# EAGLE board 14140^6 (EAGLE 7.6.0)
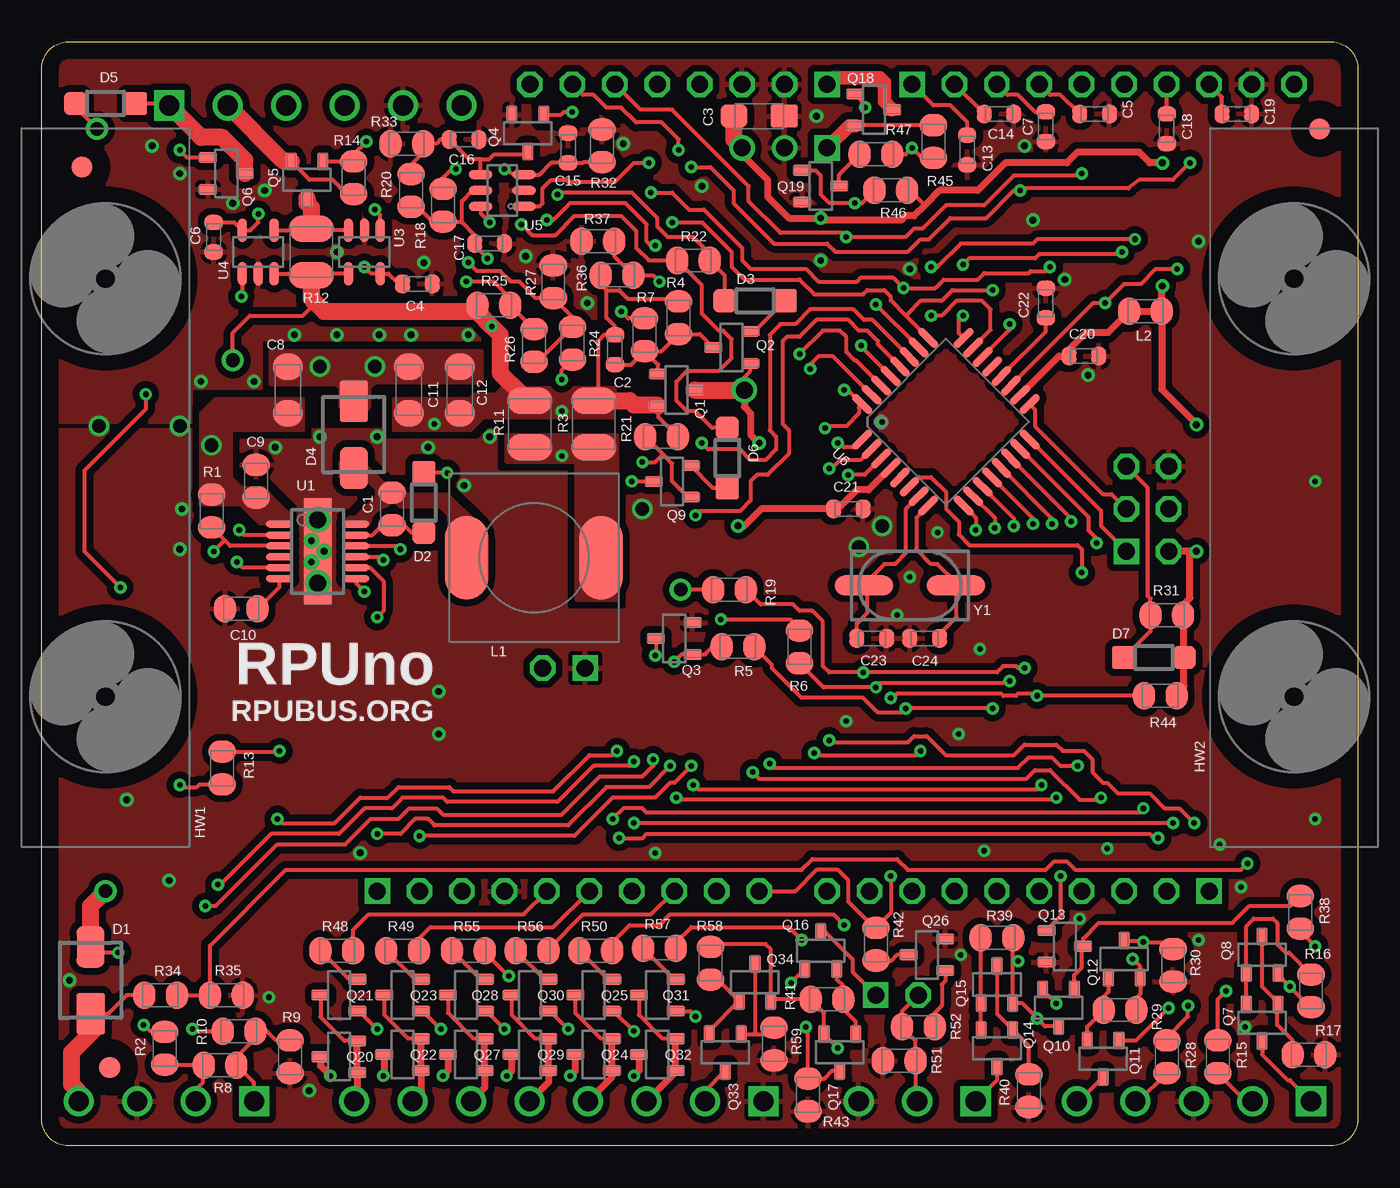
[diagram p1: board, top side]
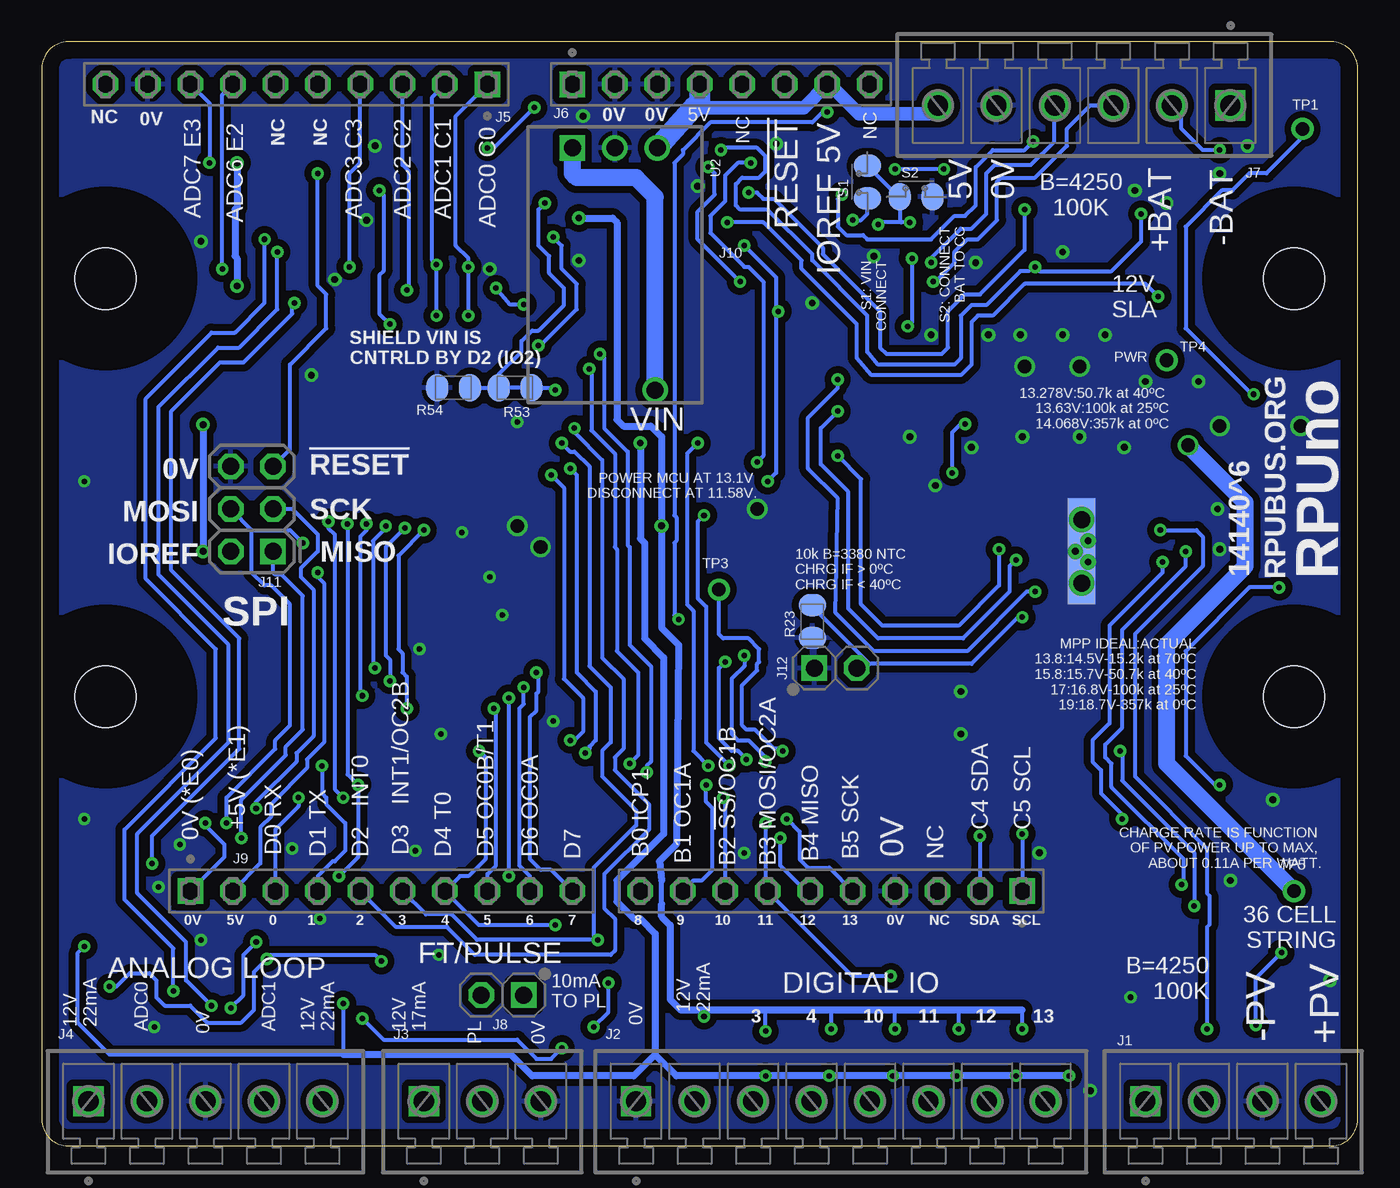
[diagram p2: board, bottom side, seen from below]

Size 78.74 x 66.04 mm. Coordinates in mm from the lower left corner, seen from the top.
Outline: 78.74,64.45 78.74,1.59 arc-90 77.15,0 1.59,0 arc-90 0,1.59 0,64.45 arc-90 1.59,66.04 77.15,66.04 arc-90 78.74,64.45
Copper layers (1*16): Top 0.034290625mm / dielectric 60mil / Bottom 0.034290625mm
Design rules "default *": minimum track width 10mil, minimum drill 13mil, track to track 12mil, track to pad 10mil, pad to pad 8mil, via to via 12mil, smd to smd 8mil, copper to edge 40mil, drill to drill 16mil, minimum pad ring 10mil, minimum via ring 8mil, stop-mask expansion 4mil, vias tented up to drill 17mil, thermal gap 10mil
Net classes: 0 default: width 0.254 mm, drill 0.33 mm

## Footprints (pad centres in the part's own frame; a part is rotated, then mirrored left to right if it is on the bottom)
C0805(2012) = smd 1.321 x 1.651: 1 -0.977,0; 2 0.977,0
C0603(1608) = smd 0.898 x 1.1: 1 -0.889,0; 2 0.889,0
3216 = smd 1.6 x 1.4: + -1.5,0; - 1.5,0
C1206(3216) = smd 1.6 x 1.8: 1 -1.4,0; 2 1.4,0
SMA = smd 2.5 x 1.7: A 2,0; K -2,0
SOD123 = smd 1.4 x 1.4: A 1.8,0; C -1.8,0
USA10 = hole 3.658: -12.5,0; 12.5,0
MCV4 = drill 1.2 square: 1 0,0 | drill 1.2: 2 3.5,0; 3 7,0; 4 10.5,0
MCV8 = drill 1.2 square: 1 0,0 | drill 1.2: 2 3.5,0; 3 7,0; 4 10.5,0; 5 14,0; 6 17.5,0; 7 21,0; 8 24.5,0
MCV3 = drill 1.2 square: 1 0,0 | drill 1.2: 2 3.5,0; 3 7,0
MCV5 = drill 1.2 square: 1 0,0 | drill 1.2: 2 3.5,0; 3 7,0; 4 10.5,0; 5 14,0
F1X10 = drill 1.016 square: 1 0,0 | drill 1.016 octagon: 2 2.54,0; 3 5.08,0; 4 7.62,0; 5 10.16,0; 6 12.7,0; 7 15.24,0; 8 17.78,0; 9 20.32,0; 10 22.86,0
F1X8 = drill 1.016 square: 1 0,0 | drill 1.016 octagon: 2 2.54,0; 3 5.08,0; 4 7.62,0; 5 10.16,0; 6 12.7,0; 7 15.24,0; 8 17.78,0
MCV6 = drill 1.2 square: 1 0,0 | drill 1.2: 2 3.5,0; 3 7,0; 4 10.5,0; 5 14,0; 6 17.5,0
1X2 = drill 1.016 square: 1 0,0 | drill 1.016 octagon: 2 2.54,0
ISP = drill 1.016 square: 1 0,0 | drill 1.016 octagon: 2 0,2.54; 3 2.54,0; 4 2.54,2.54; 5 5.08,0; 6 5.08,2.54
L3939 = smd 2.6 x 5: 1 4.05,0; 2 -4.01,0
SOT23 = smd 0.65 x 1.06: 1(G) -0.95,-1.1; 2(S) 0.95,-1.1; 3(D) 0,1.1
SOT23' = smd 0.65 x 1.06: B -0.95,-1.1; C 0,1.1; E 0.95,-1.1
C1210(3225) = smd 1.6 x 2.7: 1 -1.4,0; 2 1.4,0
P1-08 = drill 0.813: TP 0,0
12MSOP-EDP-HAND = smd 0.42 x 1.6: 1 -1.625,-2.3; 2 -0.975,-2.3; 3 -0.325,-2.3; 4 0.325,-2.3; 5 0.975,-2.3; 6 1.625,-2.3; 7 1.625,2.3; 8 0.975,2.3; 9 0.325,2.3; 10 -0.325,2.3; 11 -0.975,2.3; 12 -1.625,2.3 | smd 6.35 x 1.651: SNK0 0,0 | smd 6.35 x 1.651 bottom: SNK1 0,0 | drill 1.016: SNK3 -1.905,0; SNK5 1.905,0 | drill 0.406: SNK4 0,0.381; SNK6 -0.635,-0.381; SNK7 0.635,-0.381
OKI-78SR-H = drill 1.016 square: 1 0,0 | drill 1.016: 2 -2.54,0; 3 -5.08,0
SOT23-5 = smd 0.55 x 1.4: 1 -0.95,-1.3; 2 0,-1.3; 3 0.95,-1.3; 4 0.95,1.3; 5 -0.95,1.3
SOT23-6 = smd 0.55 x 1.4: 1 -0.95,-1.3; 2 0,-1.3; 3 0.95,-1.3; 4 0.95,1.3; 5 0,1.3; 6 -0.95,1.3
TQFP32-08 = smd 1.5 x 0.45: 1 -4.293,2.8; 2 -4.293,2; 3 -4.293,1.2; 4 -4.293,0.4; 5 -4.293,-0.4; 6 -4.293,-1.2; 7 -4.293,-2; 8 -4.293,-2.8; 17 4.293,-2.8; 18 4.293,-2; 19 4.293,-1.2; 20 4.293,-0.4; 21 4.293,0.4; 22 4.293,1.2; 23 4.293,2; 24 4.293,2.8 | smd 0.45 x 1.5: 9 -2.8,-4.293; 10 -2,-4.293; 11 -1.2,-4.293; 12 -0.4,-4.293; 13 0.4,-4.293; 14 1.2,-4.293; 15 2,-4.293; 16 2.8,-4.293; 25 2.8,4.293; 26 2,4.293; 27 1.2,4.293; 28 0.4,4.293; 29 -0.4,4.293; 30 -1.2,4.293; 31 -2,4.293; 32 -2.8,4.293
FIDUCIAL-1.27 = smd 1.27 x 1.27: 1 0,0
CSM-3X = smd 3.5 x 1.2: 1 -2.75,0; 2 2.75,0

## Placement (x,y rotation side)
C1  1uF  [C0805(2012)]  20.95,38.1 90 top
C2  10nF  [C0603(1608)]  34.29,47.62 270 top
C3  106A  [3216]  42.93,61.59 0 top
C4  .1uF  [C0603(1608)]  22.48,51.56 0 top
C5  .01uF  [C0603(1608)]  62.99,61.72 0 top
C6  .1uF  [C0603(1608)]  10.29,54.36 270 top
C7  .01uF  [C0603(1608)]  60.07,60.96 270 top
C8  10uF  [C1206(3216)]  14.73,45.21 90 top
C9  .1uF  [C0805(2012)]  12.83,39.75 90 top
C10  1uF  [C0805(2012)]  11.94,32.13 180 top
C11  10uF  [C1206(3216)]  21.97,45.21 90 top
C12  10uF  [C1206(3216)]  25.02,45.21 90 top
C13  .01uF  [C0603(1608)]  55.37,59.56 270 top
C14  .01uF  [C0603(1608)]  57.28,61.72 0 top
C15  .1uF  [C0603(1608)]  31.5,59.69 90 top
C16  .1uF  [C0603(1608)]  25.27,60.2 0 top
C17  .1uF  [C0603(1608)]  26.8,53.98 0 top
C18  .01uF  [C0603(1608)]  67.31,60.83 270 top
C19  .01uF  [C0603(1608)]  71.5,61.72 0 top
C20  .1uF  [C0603(1608)]  62.36,47.24 0 top
C21  .1uF  [C0603(1608)]  48.26,38.1 0 top
C22  .1uF  [C0603(1608)]  60.07,50.42 90 top
C23  27pF  [C0603(1608)]  49.66,30.35 180 top
C24  27pF  [C0603(1608)]  52.83,30.35 0 top
D1  SQ4  [SMA]  2.92,9.91 270 top
D2  T4  [SOD123]  22.86,38.48 90 top
D3  T4  [SOD123]  42.67,50.55 0 top
D4  SQ4  [SMA]  18.67,42.55 90 top
D5  T4  [SOD123]  3.81,62.36 0 top
D6  T4  [SOD123]  41.02,41.15 270 top
D7  T4  [SOD123]  66.55,29.21 180 top
HW1  USA10-4,6  [USA10]  3.81,39.37 90 top
HW2  USA10-4,6  [USA10]  74.93,39.37 90 top
J1  PST1,0/4-3,5  [MCV4]  12.7,2.67 0 bottom
J2  PST1,0&8-3,5  [MCV8]  43.18,2.67 0 bottom
J3  PST1,0/3-3,5  [MCV3]  55.88,2.67 0 bottom
J4  PST1,0/5-3,5  [MCV5]  75.95,2.67 0 bottom
J5  PPPC101LFBN  [F1X10]  52.07,63.5 180 bottom
J6  PPPC081LFBN  [F1X8]  46.99,63.5 0 bottom
J7  PST1,0/6-3,5  [MCV6]  7.62,62.23 180 bottom
J8  [1X2]  49.91,9.02 180 bottom
J9  PPPC101LFBN  [F1X10]  69.85,15.24 0 bottom
J10  PPPC101LFBN  [F1X10]  20.07,15.24 180 bottom
J11  ICSP  [ISP]  64.9,35.56 90 bottom
J12  [1X2]  32.51,28.57 0 bottom
L1  15uH 2A2  [L3939]  29.46,35.18 180 top
L2  JMP  [C0805(2012)]  66.04,49.91 180 top
Q1  DMB  [SOT23]  37.97,45.21 270 top
Q2  K38  [SOT23]  41.27,47.75 90 top
Q3  K1N  [SOT23']  37.85,30.35 90 top
Q4  K1N  [SOT23']  29.08,60.58 180 top
Q5  DMB  [SOT23]  15.88,57.78 180 top
Q6  34N  [SOT23]  11.05,58.17 270 top
Q7  K3N  [SOT23']  73.03,7.37 180 top
Q8  K3N  [SOT23']  73.03,11.43 0 top
Q9  K38  [SOT23]  37.72,39.75 90 top
Q10  K84  [SOT23]  60.83,8.26 180 top
Q11  K3N  [SOT23']  63.5,5.21 180 top
Q12  K3N  [SOT23']  64.77,11.18 0 top
Q13  K38  [SOT23]  61.21,11.94 270 top
Q14  K3N  [SOT23']  57.15,5.84 180 top
Q15  K3N  [SOT23']  57.15,9.65 0 top
Q16  K3N  [SOT23']  46.61,11.68 0 top
Q17  K3N  [SOT23']  47.75,5.59 180 top
Q18  DMB  [SOT23]  49.78,61.98 270 top
Q19  K38  [SOT23]  46.61,57.4 270 top
Q20  K1N  [SOT23']  17.78,5.33 90 top
Q21  K38  [SOT23]  17.78,9.02 90 top
Q22  K1N  [SOT23']  21.59,5.46 90 top
Q23  K38  [SOT23]  21.59,9.02 90 top
Q24  K1N  [SOT23']  33.02,5.46 90 top
Q25  K38  [SOT23]  33.02,9.02 90 top
Q26  K1N  [SOT23']  52.96,11.43 90 top
Q27  K1N  [SOT23']  25.4,5.46 90 top
Q28  K38  [SOT23]  25.4,9.02 90 top
Q29  K1N  [SOT23']  29.21,5.46 90 top
Q30  K38  [SOT23]  29.21,9.02 90 top
Q31  K38  [SOT23]  36.83,9.02 90 top
Q32  K1N  [SOT23']  36.83,5.46 90 top
Q33  K3N  [SOT23']  40.89,5.59 180 top
Q34  K3N  [SOT23']  42.67,9.78 0 top
R1  10k  [C0805(2012)]  10.16,37.97 270 top
R2  205k  [C0805(2012)]  7.37,5.84 270 top
R3  0R068  [C1210(3225)]  33.02,43.18 270 top
R4  100k  [C0805(2012)]  38.1,49.53 270 top
R5  10k  [C0805(2012)]  41.66,29.84 180 top
R6  10k  [C0805(2012)]  45.34,29.84 90 top
R7  10k  [C0805(2012)]  36.07,48.51 90 top
R8  121k  [C0805(2012)]  10.67,4.83 0 top
R9  49.9k  [C0805(2012)]  14.86,5.33 270 top
R10  20k  [C0805(2012)]  11.81,6.86 180 top
R11  OPEN  [C1210(3225)]  29.21,43.18 270 top
R12  0R068  [C1210(3225)]  16.13,53.47 270 top
R13  10k  [C0805(2012)]  10.79,22.61 270 top
R14  100k  [C0805(2012)]  18.67,57.91 90 top
R15  1.5k  [C0805(2012)]  70.36,5.33 270 top
R16  27  [C0805(2012)]  75.95,9.27 270 top
R17  49.9k  [C0805(2012)]  75.82,5.46 180 top
R18  316k  [C0805(2012)]  24,56.26 90 top
R19  10k  [C0805(2012)]  41.15,33.27 180 top
R20  280k  [C0805(2012)]  22.1,57.15 90 top
R21  100k  [C0805(2012)]  37.08,42.42 180 top
R22  5.62k  [C0805(2012)]  38.99,52.96 180 top
R23  **10k  [C0805(2012)]  32.64,31.37 270 bottom
R24  200k  [C0805(2012)]  31.75,48.01 90 top
R25  182k  [C0805(2012)]  27.05,50.29 0 top
R26  45.3k  [C0805(2012)]  29.46,47.88 270 top
R27  68.1k  [C0805(2012)]  30.61,51.69 270 top
R28  1.5k  [C0805(2012)]  67.31,5.33 270 top
R29  27  [C0805(2012)]  64.52,8.13 0 top
R30  49.9k  [C0805(2012)]  67.69,10.79 90 top
R31  10K  [C0805(2012)]  67.31,31.75 0 top
R32  10k  [C0805(2012)]  33.53,59.82 90 top
R33  10k  [C0805(2012)]  21.84,59.94 180 top
R34  432k  [C0805(2012)]  7.11,9.02 180 top
R35  100k  [C0805(2012)]  11.05,9.02 180 top
R36  200k  [C0805(2012)]  34.42,52.07 180 top
R37  100k  [C0805(2012)]  33.27,54.1 0 top
R38  100K  [C0805(2012)]  75.31,13.97 270 top
R39  32.4  [C0805(2012)]  57.15,12.45 0 top
R40  49.9k  [C0805(2012)]  59.05,3.3 90 top
R41  60.4  [C0805(2012)]  46.99,8.76 180 top
R42  182  [C0805(2012)]  49.91,12.06 90 top
R43  49.9k  [C0805(2012)]  45.85,3.05 90 top
R44  10k  [C0805(2012)]  66.93,26.92 180 top
R45  100k  [C0805(2012)]  53.34,60.07 270 top
R46  10k  [C0805(2012)]  50.8,57.15 0 top
R47  10k  [C0805(2012)]  49.91,59.31 180 top
R48  182  [C0805(2012)]  17.65,11.68 0 top
R49  182  [C0805(2012)]  21.59,11.68 0 top
R50  182  [C0805(2012)]  33.15,11.68 0 top
R51  100  [C0805(2012)]  51.31,5.08 0 top
R52  10k  [C0805(2012)]  52.45,7.11 0 top
R53  JMP  [C0805(2012)]  50.42,45.34 180 bottom
R54  OPEN  [C0805(2012)]  54.1,45.34 180 bottom
R55  182  [C0805(2012)]  25.53,11.68 0 top
R56  182  [C0805(2012)]  29.34,11.68 0 top
R57  182  [C0805(2012)]  36.96,11.81 0 top
R58  27  [C0805(2012)]  40.01,10.92 90 top
R59  49.9k  [C0805(2012)]  43.81,6.1 90 top
S1  PAD  [C0805(2012)]  29.34,57.66 90 bottom
S2  PAD  [C0805(2012)]  26.42,56.77 0 bottom
TP1  TPPAD1-08  [P1-08]  3.3,60.83 0 bottom
TP3  TPPAD1-08  [P1-08]  38.23,33.27 0 bottom
TP4  TPPAD1-08  [P1-08]  11.43,46.99 0 bottom
TP5  TPPAD1-08  [P1-08]  3.81,15.24 0 bottom
U1  LT3652  [12MSOP-EDP-HAND]  16.51,35.56 270 top
U2  I50115  [OKI-78SR-H]  46.99,59.69 180 bottom
U3  1087  [SOT23-5]  19.3,53.47 180 top
U4  1087  [SOT23-5]  12.95,53.47 0 top
U5  TPS3700  [SOT23-6]  27.56,57.15 90 top
U6  ATMEGA328PB-AU  [TQFP32-08]  54.1,43.31 45 top
U$1  ARDUINO-UNO  [ARDUINO_UNO]  1.27,66.04 180 bottom
U$2  FIDUCIAL1.27  [FIDUCIAL-1.27]  76.45,60.83 0 top
U$3  FIDUCIAL1.27  [FIDUCIAL-1.27]  2.41,58.55 0 top
U$4  FIDUCIAL1.27  [FIDUCIAL-1.27]  4.06,4.7 0 top
Y1  16MHz  [CSM-3X]  51.94,33.53 0 top

## Tracks (layer width: path | path; a pad name or v marks a point on that pad's centre or on a via)
0V  (via drill 0.33, 0.41, 0.81)
  other vias: 16.64,46.61 19.94,46.61 25.53,48.51 22.1,48.51 20.19,48.51 17.65,48.51 15.11,48.51 3.43,43.05 12.7,45.72 9.53,45.72 23.75,24.64 23.75,27.18 8.38,38.1 8.26,35.69 8.26,58.17 6.6,59.82 11.43,56.39 13.34,57.15 13.97,41.78 16.64,42.42 20.07,42.42 25.27,39.5 26.8,42.42 23.11,41.78 62.1,13.59 54.99,11.43 51.94,34.04 51.18,31.75 62.61,46.1 61.21,51.82 69.22,12.32 72.01,7.11 63.75,17.78 56.13,29.72 53.59,36.7 13.59,8.89 71.75,15.49 17.65,53.47 48.13,25.4 54.86,24.64 56.39,17.65 36.7,17.53 70.48,18.03 76.2,19.56 76.2,39.75 39.5,57.4 28.96,53.21 32.64,50.42 34.8,59.94 46.61,52.96 69.22,54.1 5.08,20.7 7.62,15.88 19.05,17.53 16,3.3 50.29,43.31 58.8,59.82 59.31,55.37 51.94,52.45 8.26,43.05 35.94,38.1 50.29,37.08 48.9,35.81 22.86,52.83 46.35,61.59 1.65,9.91
  pour Bottom (isolate 0.406): 0,66.04 78.74,66.04 78.74,0 0,0
  pour Top (isolate 0.406, rank 6): 0,66.04 78.74,66.04 78.74,0 0,0 0,42.8 35.56,42.8 35.56,49.53 26.67,49.53 26.67,48.26 13.08,48.26 13.08,45.34 8.89,45.34 8.89,43.31 0,43.31
  pour Top (no thermals): 13.72,47.5 26.29,47.5 26.29,45.72 19.94,45.72 19.56,45.34 19.56,44.2 19.3,43.94 18.16,43.94 17.91,44.2 17.91,45.34 17.65,45.59 13.72,45.59
22MA_A0
  Top 0.254: Q7.C 73.03,5.46 74.55,3.94 74.68,3.94 J4.1
22MA_A1
  Top 0.254: J4.5 62.06,2.67 Q11.C
22MA_DIO
  Top 0.254: J2.2 39.68,3.27 Q33.C
!FAULT  (via drill 0.33)
  Top 0.254: U1.5 12.02,34.59 v11.68,34.92 | v14.1,19.56 14.35,19.3 17.53,19.3 19.05,20.83 20.7,20.83 21.34,21.46 24.38,21.46 24.64,21.21 30.61,21.21 32.77,23.37 34.16,23.37 v34.42,23.62 | R19.2 TP3.TP
  Bottom 0.254: v11.68,34.92 11.68,34.29 14.86,31.11 14.86,25.27 15.88,24.26 15.88,22.99 15.37,22.48 15.37,21.08 13.97,19.68 v14.1,19.56 | v34.42,23.62 34.54,23.75 34.92,23.75 36.07,24.89 36.58,24.89 36.83,25.15 36.83,27.56 35.94,28.45 35.94,28.83 35.81,28.96 35.81,29.72 36.45,30.35 37.97,30.35 38.23,30.61 TP3.TP
!RESET!  (via drill 0.33)
  Top 0.254: D7.A 64.77,29.21 66.33,30.77 R31.1 66.33,32.73 66.17,32.89 66.17,39.37 J11.5 | v62.23,58.17 61.98,58.17 61.85,58.04 58.17,58.04 56.39,56.26 54.1,56.26 52.7,54.86 52.2,54.86 51.69,54.36 v48.13,54.36 47.88,54.61 44.2,54.61 42.29,56.52 42.29,57.4 37.72,61.98 35.81,61.98 J6.6 | U6.29 49.02,47.82 v49.02,47.88
  Bottom 0.254: J11.5 63.88,41.66 63.88,46.74 61.72,48.9 61.72,50.93 62.23,51.44 v62.23,58.17 | v49.02,47.88 48.9,47.88 46.74,50.04 46.74,51.56 47.62,52.45 47.62,53.85 v48.13,54.36
!SS  (via drill 0.33)
  Top 0.254: R56.2 30.31,11.77 32.38,13.84 36.45,13.84 J10.8 | U6.14 61.59,37.51 v61.59,37.34 | v60.71,20.83 60.58,20.7 38.1,20.7 v37.97,20.83
  Bottom 0.254: v61.59,37.34 61.59,36.96 61.21,36.58 61.21,21.34 v60.71,20.83 | v37.97,20.83 37.85,20.7 J10.8
+5V  (via drill 0.33, 0.41)
  Top 0.254: C6.1 11.53,55.24 U4.5 12.48,54.77 12.95,55.24 v12.95,55.75 | Q21.1(G) 18.98,8.07 v20.07,6.99 | Q23.1(G) 22.79,8.07 v23.88,6.99 | Q28.1(G) 26.6,8.07 v27.69,6.99 | Q30.1(G) 30.41,8.07 v31.5,6.99 | Q25.1(G) 34.22,8.07 v35.43,6.86 | Q31.1(G) 38.8,8.07 v39.12,7.75 | v19.3,52.58 19.71,52.17 U3.5 20.73,52.17 21.34,51.56 C4.1 | v38.1,59.56 38.1,60.2 37.08,61.21 35.56,61.21 34.67,62.1 33.78,62.1 33.02,62.87 32.38,62.87 J6.7 | R46.2 51.94,57.15 52.83,56.26
  Top 0.406: 41.66,59.69 U2.3 41.91,59.31 43.43,57.78 43.43,56.77 44.7,55.5 v46.61,55.5 46.74,55.37 51.44,55.37 51.69,55.63 52.2,55.63 52.83,56.26 53.72,57.15 56.01,57.15 57.66,58.8 61.34,58.8 61.98,59.44 65.66,59.44 66.29,58.8 v67.06,58.8 | L2.1 67.02,51.4 v67.06,51.44 | L2.1 67.02,45.25 69.09,43.18 v69.09,43.14 | v69.09,35.56 68.83,35.56 | 68.83,35.56 J11.2 | R44.1 68.35,27.49 D7.C 68.35,31.69 R31.2 68.29,32.35 68.71,32.77 68.71,35.43 68.83,35.56 | U6.4 49.47,39.24 48.77,39.24 47.62,38.1 C21.1 43.05,38.1 42.04,37.08 v41.66,37.08 | U6.18 60.87,47.24 C20.1 61.47,47.62 62.48,48.64 63.79,48.64 L2.2 L2.1
  Top 1.016: C3.+ 41.4,61.72 41.4,60.2 U2.3 41.93,59.92
  Bottom 0.254: v20.07,6.99 20.07,8 20.19,8.13 | v23.88,6.99 23.88,8.13 | v27.69,6.99 27.69,8.13 | v31.5,6.99 31.5,8.13 | v35.43,6.86 35.43,8.13 | v39.12,7.75 39.12,8.13 | v12.95,55.75 12.95,54.1 14.73,52.32 19.05,52.32 v19.3,52.58 19.68,52.32 20.19,52.32 22.23,50.29 23.11,50.29 23.75,49.66 23.75,47.12 24.13,46.74 28.7,46.74 29.34,47.5 29.34,49.66 32.64,52.96 32.64,53.34 35.31,56.01 36.96,56.01 37.21,56.26 37.21,57.53 36.83,57.91 35.81,57.91 35.43,58.29 35.43,59.18 35.94,59.69 37.97,59.69 v38.1,59.56
  Bottom 0.305: 41.66,14.48 41.66,15.88
  Bottom 0.406: v46.61,55.5 44.58,55.5 44.32,55.24 44.32,43.43 43.94,43.05 42.29,43.05 41.66,42.42 v41.66,37.08 41.66,30.99 40.64,29.97 40.77,18.03 41.78,17.02 41.66,15.88 | 20.07,8.13 20.19,8.13 23.88,8.13 27.69,8.13 31.5,8.13 35.43,8.13 39.12,8.13 40.51,8.13 41.15,8.76 41.15,13.21 41.66,13.72 41.66,14.48 | v67.06,58.8 67.06,56.13 67.18,56.01 67.18,53.21 67.06,53.09 v67.06,51.44 | v69.09,43.14 v69.09,35.56
  Bottom 0.813: 39.62,62.23 39.5,62.1 33.15,62.1 J6.7 31.62,63.5 29.84,61.72 25.63,61.72 J7.6
  Bottom 1.016: 39.62,62.23 39.37,62.48
  Bottom 1.27: U2.3 39.62,62.23 | 39.37,62.48 J6.4
+BAT  (via drill 0.33)
  Top 0.254: R14.1 18.25,56.94 17.4,57.78 16.02,57.78 Q5.2(S) | Q6.1(G) 8.7,59.12 v8.26,59.56
  Top 1.016: Q5.2(S) 14.42,58.93 J7.2
  Bottom 0.254: v8.26,59.56 9.27,59.56 10.54,60.83 10.54,61.65 J7.2
-BAT
  Top 0.254: D5.A 7.49,62.36 J7.1
  Top 1.016: Q6.3(D) 12.15,58.97 10.79,60.33 9.53,60.33 J7.1
ADC0  (via drill 0.33)
  Top 0.254: U6.23 56.77,48.8 56.77,50.04 56.26,50.55 54.74,50.55 53.85,49.66 v53.21,49.66 | R15.1 70.36,8.76 v70.87,9.27 | v65.41,54.23 59.56,54.23 59.31,53.98 54.99,53.98 53.59,52.58 v53.21,52.58 | C13.1 55.37,61.21 54.36,62.23 53.34,62.23 J5.1
  Bottom 0.254: v53.21,49.66 v53.21,52.58 53.21,53.09 53.98,53.85 53.98,61.59 J5.1 | v70.87,9.27 70.87,11.81 73.79,14.73 73.79,18.92 68.33,24.38 68.33,29.72 72.52,33.91 72.52,44.7 68.58,48.64 67.18,48.64 65.41,50.42 v65.41,54.23
ADC1  (via drill 0.33)
  Top 0.254: U6.24 54.86,48.62 54.86,49.4 v55.12,49.66 | R28.1 67.31,6.48 68.58,7.75 v68.58,8.38 | v64.64,53.47 64.52,53.34 59.69,53.34 59.44,53.09 55.5,53.09 v55.12,52.7 | C14.1 J5.2
  Bottom 0.254: v55.12,49.66 v55.12,52.7 55.37,52.96 55.37,62.74 J5.2 | v68.58,8.38 70.1,9.91 70.1,12.19 73.03,15.11 73.03,18.67 67.56,24.13 67.56,29.97 71.75,34.16 71.75,44.2 68.2,47.75 66.93,47.75 64.64,50.04 v64.64,53.47
AREF
  Top 0.254: U6.20 60.07,48.71 C22.1
BAT-DISCON  (via drill 0.33)
  Top 0.254: Q5.1(G) R14.2 18.67,59.31 v19.43,60.07 | D3.C 40.87,52.05 R22.1 39.97,53.38 38.99,54.36 37.47,54.36 36.83,54.99 36.83,55.5 35.31,57.02 31.11,57.02 v30.86,56.9
  Bottom 0.254: v30.86,56.9 31.11,56.64 31.11,54.99 30.61,54.48 29.59,54.48 29.34,54.23 25.53,54.23 24.13,55.63 23.5,55.63 22.86,56.26 22.86,58.55 21.84,59.56 19.94,59.56 v19.43,60.07
BAT_I
  Top 0.254: U4.4 16.03,54.77 R12.1 16.23,54.77 U3.3
  Top 1.016: Q5.3(D) 15.88,56.39 16.13,56.13 R12.1
CHRG_ADC2  (via drill 0.33)
  Top 0.254: U6.25 51.7,49.67 | 51.7,49.67 50.8,50.57 50.8,50.8 50.42,51.18 49.4,51.18 49.15,50.93 46.23,50.93 45.34,51.82 42.04,51.82 41.27,52.58 41.27,53.47 39.5,55.24 v37.72,55.24 | v56.9,51.18 54.48,51.18 53.85,50.55 52.58,50.55 51.7,49.67 | U4.1 12,50.87 v11.94,50.8 | C7.1 59.44,61.85 58.42,62.87 57.78,62.87 J5.3
  Bottom 0.254: v56.9,51.18 56.77,51.31 56.77,58.29 57.15,58.67 J5.3 | v11.94,50.8 12.7,51.56 19.94,51.56 21.84,49.66 22.73,49.66 23.11,49.28 23.11,46.74 23.75,46.1 29.08,46.1 29.97,47.12 29.97,49.15 33.27,52.45 33.27,52.96 35.56,55.24 v37.72,55.24
CS_PWR  (via drill 0.33)
  Top 0.254: 46.04,8.36 R41.2 | 58.1,11.05 Q15.E 58.63,8.55 v59.56,7.62 60.03,7.16 Q10.3(D) | 58.1,11.05 58.1,12.42 R39.2 | R41.2 46.8,7.97 Q17.E 46.8,6.67 v47.62,5.84 | R41.2 43.71,8.76 Q34.E 43.62,11.75 43.31,12.06 40.17,12.06 R58.2 | v65.28,11.18 65.72,10.73 Q12.E 65.72,9.08 65.49,8.85 R29.2 | v58.42,11.05 58.1,11.05 | R16.2 75.91,8.29 v74.68,9.53 73.97,10.23 Q8.E
  Bottom 0.254: v59.56,7.62 58.29,6.35 50.29,6.35 49.15,5.21 48.26,5.21 v47.62,5.84 | v58.42,11.05 58.8,11.43 65.02,11.43 v65.28,11.18 66.04,10.41 66.04,8.13 66.8,7.37 68.83,7.37 69.85,8.38 71.37,8.38 71.88,8.89 71.88,9.91 72.31,10.33 73.47,10.33 74.27,9.53 v74.68,9.53
DISCHRG_ADC3  (via drill 0.33)
  Top 0.254: U6.26 v49.91,50.33 | v60.33,52.58 60.07,52.32 59.18,52.32 59.05,52.2 56.39,52.2 56.01,51.82 53.98,51.82 53.47,51.31 v51.56,51.31 50.93,51.94 49.02,51.94 48.77,51.69 46.48,51.69 45.72,52.45 42.42,52.45 41.91,52.96 41.91,53.72 39.62,56.01 38.73,56.01 37.72,57.02 v36.45,57.02 | U3.1 20.25,55.69 v19.94,56.01 | C5.1 60.96,62.87 60.33,62.87 J5.4
  Bottom 0.254: v49.91,50.33 50.71,50.33 v51.56,51.31 | v60.33,52.58 60.33,58.17 59.69,58.8 J5.4 | v19.94,56.01 19.94,53.59 22.61,50.93 23.5,50.93 24.51,49.91 24.51,47.75 24.89,47.37 28.19,47.37 28.57,47.75 28.57,49.91 32,53.34 32,53.72 34.92,56.64 35.56,56.64 35.94,57.02 v36.45,57.02
IO2  (via drill 0.33)
  Top 0.254: v46.86,42.93 46.99,43.05 48.13,43.05 48.9,43.81 48.9,44.17 U6.32 48.24,45.21 v48.01,45.21 | Q19.1(G) 46.29,58.35 46.61,58.04 46.61,56.9 47.12,56.39 v48.64,56.39 49.06,56.39 R46.1
  Bottom 0.254: J9.5 57.53,13.08 54.48,13.08 52.83,11.43 44.7,11.43 44.45,11.68 44.45,13.59 45.09,14.22 45.09,16.26 42.42,18.92 42.42,20.45 44.45,22.48 44.45,23.24 43.94,23.75 43.94,27.94 45.21,29.21 45.21,41.02 46.86,42.67 v46.86,42.93 | v48.01,45.21 48.13,45.34 R53.1 R53.2 | R53.2 51.4,46.14 50.04,47.5 50.04,48.13 49.4,48.77 49.02,48.77 47.5,50.29 47.5,51.31 48.39,52.2 48.39,53.21 49.02,53.85 49.02,56.01 v48.64,56.39 | R54.1 R53.2
IO3  (via drill 0.33)
  Top 0.254: R57.2 37.93,12.15 38.86,13.08 44.7,13.08 v45.47,12.32 | U6.1 49.06,42.25 48.59,41.78 48.01,41.78 47.75,42.04 v47.62,42.04
  Bottom 0.254: J9.6 55.75,13.84 54.23,13.84 52.7,12.32 v45.47,12.32 45.72,12.57 45.72,16.64 43.18,19.18 43.18,20.07 45.21,22.1 45.21,23.62 44.7,24.13 44.7,27.43 45.97,28.7 45.97,40.64 46.86,41.53 47.12,41.53 v47.62,42.04
IO3_
  Top 0.254: Q32.E 37.15,6.41 35.73,7.83 Q31.3(D) | Q32.B 37.93,4.42
  Top 0.406: 37.93,4.42 J2.3 | Q32.B Q32.E
IO4  (via drill 0.33)
  Top 0.254: R50.2 34.12,12.15 35.18,13.21 36.96,13.21 37.59,13.84 47.37,13.84 v48.01,13.21 | U6.2 48.99,41.02 47.75,41.02 47.24,40.51 v47.12,40.51 | v46.23,23.5 46.35,23.37 52.32,23.37 v52.58,23.62
  Bottom 0.254: v48.01,13.21 52.58,13.21 J9.7 53.72,16.13 53.21,16.13 52.2,17.14 52.2,23.24 v52.58,23.62 | v47.12,40.51 46.74,40.13 46.74,28.32 45.59,27.18 45.59,24.26 45.97,23.88 45.97,23.75 v46.23,23.5
IO4_
  Top 0.254: Q24.E 33.47,6.41 31.92,7.96 Q25.3(D)
  Top 0.406: J2.4 34.12,4.11 Q24.B Q24.E
IO5  (via drill 0.33)
  Top 0.254: U6.9 55.88,37.57 v55.88,36.83 | v56.9,26.16 v51.69,26.16 51.44,25.91 50.04,25.91 49.15,26.8 45.47,26.8 43.69,28.57 43.69,28.79 R5.1
  Bottom 0.254: v55.88,36.83 57.4,35.31 57.4,29.72 57.15,29.46 57.15,28.32 56.9,28.07 v56.9,26.16 | J9.8 52.07,16.26 51.56,16.76 51.56,25.91 v51.69,26.16
IO6  (via drill 0.33)
  Top 0.254: R6.1 46.77,27.43 v49.91,27.43 50.16,27.69 57.53,27.69 57.66,27.81 v57.91,27.81 | U6.10 57.02,37.56 v57.02,36.96
  Bottom 0.254: J9.9 49.53,16.13 50.16,16.76 50.16,26.16 49.91,26.42 v49.91,27.43 | v57.02,36.96 58.17,35.81 58.17,29.34 57.91,29.08 v57.91,27.81
IO7  (via drill 0.33)
  Top 0.254: U6.11 58.17,37.55 v58.17,37.08 | v58.8,28.57 58.42,28.57 58.29,28.7 57.53,28.7 57.15,28.32 v49.15,28.32 47.12,28.32 46.74,28.7 46.74,31.37 46.1,32 45.34,32 44.96,32.38 43.01,32.38 R19.1
  Bottom 0.254: v58.17,37.08 58.17,36.96 58.93,36.2 58.93,28.7 v58.8,28.57 | J9.10 48.26,16.51 48.9,16.51 49.53,17.14 49.53,25.65 49.15,26.04 49.15,27.05 49.02,27.18 49.02,28.19 v49.15,28.32
IO8  (via drill 0.33)
  Top 0.254: J10.10 45.09,15.24 46.35,16.51 47.62,16.51 48.26,15.88 48.26,14.61 49.53,13.34 49.62,13.34 R42.2 50.8,13.93 v50.8,16.13 | R44.2 v59.56,26.92 59.44,27.05 58.42,27.05 58.29,26.92 57.53,26.92 57.4,27.05 51.18,27.05 50.93,26.8 v50.8,26.8 | U6.12 59.31,37.53 v59.31,37.21
  Bottom 0.254: v50.8,26.8 v50.8,16.13 | v59.31,37.21 59.31,36.83 59.69,36.45 59.69,27.05 v59.56,26.92
IO9  (via drill 0.33)
  Top 0.254: U6.13 60.45,37.52 v60.45,37.21 | v60.96,16.13 60.96,13.73 Q13.1(G) | v38.99,21.59 39.24,21.34 59.56,21.34 v59.82,21.59
  Bottom 0.254: v60.45,37.21 60.45,22.23 v59.82,21.59 59.82,17.27 v60.96,16.13 | J10.9 39.75,15.88 39.24,15.88 38.61,16.51 38.61,20.19 38.99,20.57 v38.99,21.59
IO10_
  Top 0.254: Q29.E 29.53,6.41 28.11,7.83 Q30.3(D)
  Top 0.406: Q29.E Q29.B 30.31,3.8 J2.5
IO11_
  Top 0.254: Q27.E 25.85,6.41 24.3,7.96 Q28.3(D)
  Top 0.406: Q27.E Q27.B 26.5,3.49 J2.6
IO12_
  Top 0.254: Q22.E 21.91,6.41 20.49,7.83 Q23.3(D)
  Top 0.406: J2.7 22.69,3.18 Q22.B Q22.E
IO13_
  Top 0.254: Q20.E 18.1,6.28 16.68,7.7 Q21.3(D)
  Top 0.406: J2.8 18.88,2.87 Q20.B Q20.E
MISO  (via drill 0.33)
  Top 0.254: R49.2 22.57,12.41 23.24,13.08 30.61,13.08 J10.6 | U6.16 63.37,38 63.37,37.08 J11.1 | v34.54,18.41 35.94,18.41 36.2,18.67 66.29,18.67 66.55,18.41 v66.8,18.41
  Bottom 0.254: J10.6 33.02,15.24 34.54,16.76 v34.54,18.41 | v66.8,18.41 66.8,20.7 64.14,23.37 64.14,23.88 63.12,24.89 63.12,32.89 64.39,34.16 64.77,34.16 64.9,34.29 J11.1
MOSI  (via drill 0.33)
  Top 0.254: R55.2 26.5,11.6 v27.94,10.16 | U6.15 62.61,37.63 62.61,36.83 63.12,36.32 v63.12,36.07 | v67.69,19.3 v35.43,19.3
  Bottom 0.254: v27.94,10.16 30.23,10.16 J10.7 35.43,15.37 v35.43,19.3 | J11.4 66.17,36.83 | 66.17,36.83 63.88,36.83 v63.12,36.07 | v67.69,19.3 67.69,20.83 64.77,23.75 64.77,24.26 63.88,25.15 63.88,32.38 65.02,33.53 65.41,33.53 66.17,34.29 66.17,36.83
N$1
  Top 0.254: U1.6 14.21,33.43 C10.1
N$2  (via drill 0.33)
  Top 0.254: U1.7 18.81,33.64 v19.3,33.15 | v31.11,45.85 31.11,46.39 R24.1
  Bottom 0.254: v19.3,33.15 19.81,33.15 23.37,29.59 28.96,29.59 31.24,31.88 31.11,38.73 32.89,40.51 32.89,43.56 31.11,45.34 v31.11,45.85
N$3
  Top 0.254: J1.1 12.7,3.77 R8.2 11.64,5.29 12.45,6.1 12.45,6.52 R10.1 13.46,6.86 13.97,6.35 14.82,6.35 R9.1
N$4  (via drill 0.33)
  Top 0.254: U1.3 11.27,35.88 10.94,36.22 | 10.94,36.22 R1.2 | Q3.C 36.75,29.38 v36.7,29.34 | v35.43,22.99 35.18,22.73 33.02,22.73 30.86,20.57 24.26,20.57 24,20.83 21.59,20.83 20.95,20.19 19.3,20.19 17.78,18.67 13.72,18.67 10.67,15.62 v10.54,15.62 | v10.29,35.56 10.94,36.22
  Bottom 0.254: v36.7,29.34 36.7,28.7 37.47,27.94 37.47,24.64 37.08,24.26 36.45,24.26 35.43,23.24 v35.43,22.99 | v10.54,15.62 10.41,15.75 10.41,17.14 14.73,21.46 14.73,22.86 15.11,23.24 15.11,24 14.1,25.02 14.1,30.86 10.29,34.67 v10.29,35.56
N$6  (via drill 0.33)
  Top 0.254: v40.64,31.5 44.79,31.5 R6.2 | Q4.B 31.07,61.68 31.24,61.85 v31.75,61.85
  Bottom 0.254: v31.75,61.85 32,61.85 32.64,61.21 38.73,61.21 40.39,59.56 40.39,59.31 40.89,58.8 40.89,37.72 40.77,37.59 40.77,36.2 40.89,36.07 40.89,31.75 v40.64,31.5
N$7
  Top 0.254: U5.4 26.26,59.02 | 26.26,59.02 26.77,59.02 27.05,59.31 29,59.31 Q4.C | 26.26,59.02 25.56,59.02 C16.1 23.88,60.2 23.62,59.94 R33.1 22.73,59.86 22.73,59.31 22.1,58.67 R20.2
N$8
  Top 0.254: Q2.2(S) 42.63,48.7 D3.A
N$9
  Top 0.254: J1.2 9.2,3.36 9.65,3.81 9.65,4.79 R8.1 7.41,4.83 R2.2
N$10
  Top 0.254: U1.11 19.77,36.53 20.32,37.08 20.92,37.08 C1.1 21.68,37.12 22.12,36.68 D2.C
N$11  (via drill 0.33)
  Top 0.254: U1.2 12.11,36.53 v11.81,36.83 | v9.02,6.99 9.14,6.86 R10.2
  Bottom 0.254: v9.02,6.99 9.02,13.08 8.89,13.21 8.89,14.99 9.02,15.11 9.02,17.78 13.34,22.1 13.34,30.61 9.27,34.67 9.27,36.45 9.65,36.83 v11.81,36.83
N$13  (via drill 0.33)
  Top 0.254: TP1.TP 1.91,62.23 1.91,62.36 D5.C | v6.22,44.96 6.22,44.07 2.54,40.39 2.54,35.56 v4.7,33.4 | v8.26,21.59 8.38,21.46 9.27,21.46 9.44,21.63 R13.2
  Bottom 0.254: TP1.TP 3.3,60.33 5.46,58.17 6.48,58.17 7.49,57.15 8.13,57.15 10.29,54.99 10.29,48.9 6.35,44.96 v6.22,44.96 | v4.7,33.4 6.48,33.4 10.29,29.59 10.29,23.33 8.55,21.59 v8.26,21.59
N$14
  Top 0.254: D6.A 40.17,39.35 Q9.2(S)
N$15  (via drill 0.33)
  Top 0.254: R18.2 24,57.91 24.51,58.42 v24.77,58.42 | v27.69,58.42 28.26,58.1 U5.3 29.78,58.1 30.48,58.8 C15.1 32.38,58.8 32.42,58.84 R32.1
  Bottom 0.254: v24.77,58.42 v27.69,58.42
N$16  (via drill 0.33)
  Top 0.254: Q9.1(G) 38.67,38.8 37.72,39.75 37.72,40.81 37.17,41.36 | 37.17,41.36 R21.2 | U5.1 29.78,56.2 29.97,56.39 29.97,57.28 30.48,57.78 31.37,57.78 31.5,57.66 34.29,57.66 35.43,58.8 v36.32,58.8 | v35.94,40.89 36.7,40.89 37.17,41.36
  Bottom 0.254: v36.32,58.8 37.08,58.8 37.85,58.04 37.85,56.52 38.73,55.63 38.73,54.61 36.7,52.58 36.45,52.58 35.56,51.69 35.56,41.27 v35.94,40.89
N$17  (via drill 0.33)
  Top 0.254: D6.C 40.11,42.95 39.12,43.94 38.61,43.94 37.97,44.58 37.97,45.72 38.61,46.35 40.51,46.35 41.27,47.12 41.27,48.26 40.77,48.77 40.51,48.77 39.5,49.78 39.5,51.47 R22.2 36.32,52.96 35.56,53.72 35.56,54.74 34.67,55.63 31.88,55.63 30.73,54.48 29.34,54.48 v28.7,55.12 | U5.6 26.26,55.78 v26.8,55.24
  Bottom 0.254: v26.8,55.24 27.3,55.24 | 27.3,55.24 28.7,55.24 v28.7,55.12 | 27.3,55.24 27.39,55.33 S2.1 27.47,56.77 S1.2
N$18  (via drill 0.33)
  Top 0.254: R7.2 35.09,49.49 v34.67,49.91 | v35.31,39.75 Q9.3(D) | v36.7,53.85 36.45,53.85 36.2,54.1 36.2,55.12 34.92,56.39 31.62,56.39 30.61,55.37 v30.23,55.37
  Bottom 0.254: 34.8,49.91 34.8,51.94 v36.7,53.85 | 34.8,49.91 34.8,40.26 v35.31,39.75 | v30.23,55.37 29.72,55.37 29.34,55.75 S1.1 | v34.67,49.91 34.8,49.91
N$19
  Top 0.254: Q16.C 46.91,12.78 48.51,11.18 48.51,10.41 J8.1
N$20
  Top 0.254: Q7.E Q8.B 72.08,13.15 72.52,13.59 73.66,13.59 73.91,13.34 73.91,12.06 74.42,11.56 74.64,11.56 R16.1
N$21
  Top 0.254: Q23.2(S) 22.33,9.97 R49.1
N$22
  Top 0.254: Q28.2(S) 26.27,9.97 R55.1
N$23
  Top 0.254: R17.2 74.84,6.31 73.91,7.24 73.91,8.4 Q7.B 73.97,8.57 73.03,9.53 Q8.C
N$24
  Top 0.254: J4.2 72.05,2.67 R15.2
N$25
  Top 0.254: Q10.1(G) 61.78,10.22 62.23,10.67 62.23,11.85 Q13.3(D) 62.31,12.4 63.25,13.34 71.25,13.34 72.26,14.35 74.72,14.35 R38.1
N$26
  Top 0.254: Q30.2(S) 30.08,9.97 R56.1
N$27
  Top 0.254: J4.4 65.62,2.67 R28.2
N$28
  Top 0.254: Q11.E 62.55,7.14 R29.1 63.54,8.93 63.82,9.21 Q12.B
N$29  (via drill 0.33)
  Top 0.254: Q11.B 65.49,6.31 v67.44,8.26 | R30.2 67.27,12.19 v65.91,12.19 65.83,12.28 Q12.C
  Bottom 0.254: v67.44,8.26 66.67,9.02 66.67,11.43 v65.91,12.19
N$30
  Top 0.254: Q33.E 39.94,6.9 Q34.B 40.46,9.95 R58.1
N$31
  Top 0.254: Q31.2(S) 37.82,9.97 R57.1
N$32
  Top 0.254: Q25.2(S) 33.89,9.97 R50.1
N$33
  Top 0.254: Q33.B 42.67,6.69 | 42.67,6.69 43.56,6.69 R59.2 | Q34.C 42.67,6.69
N$34
  Top 0.254: Q21.2(S) 18.39,9.97 R48.1
N$35  (via drill 0.33)
  Top 0.254: 49.4,62.23 v49.28,62.1 48.71,62.93 Q18.1(G) | R47.1 51.69,59.31 v52.07,59.69 52.67,59.09 R45.2
  Bottom 0.254: v52.07,59.69 51.69,59.69 v49.28,62.1
N$37
  Top 0.254: Q19.3(D) 47.71,58.08 R47.2
N$46  (via drill 0.33)
  Top 0.254: v9.78,14.35 10.41,14.35 14.1,18.03 18.16,18.03 19.68,19.56 21.34,19.56 21.97,20.19 23.62,20.19 24,19.81 31.11,19.81 33.4,22.1 35.94,22.1 36.58,22.73 v36.58,23.11 | v37.85,28.96 38.29,29.4 Q3.B 39.69,29.4 40.13,29.84 R5.2 | R13.1 14.19,23.58 v14.22,23.62
  Bottom 0.254: v14.22,23.62 14.1,23.5 14.1,21.84 9.78,17.53 v9.78,14.35 | v36.58,23.11 37.08,23.62 37.47,23.62 38.23,24.38 38.23,28.57 v37.85,28.96
N$107
  Top 0.254: Q26.B 54.06,9.86 53.85,9.65 53.85,8.38 53.43,7.96 R52.2
N$108
  Top 0.254: R42.1 50.84,11.09 51.18,11.43 Q26.C
N$114
  Top 0.254: Q14.E Q15.B 56.2,12.42 R39.1
N$115
  Top 0.254: U6.7 51.69,38.07 51.69,35.43 51.05,34.8 50.42,34.8 49.19,33.57 Y1.1 49.4,33.32 49.4,31.88 48.77,31.24 C23.2
N$116
  Top 0.254: C24.2 53.72,30.61 54.74,31.62 54.74,33.48 Y1.2 54.69,33.7 53.59,34.8 53.21,34.8 52.32,35.69 52.32,37.57 U6.8
N$119
  Top 0.254: Q15.C 57.15,7.89 Q14.B 59.05,5.99 R40.2
N$122
  Top 0.254: Q16.E 47.56,9.97 47.97,9.56 R41.1 47.97,8.17 48.7,7.43 Q17.B
N$123  (via drill 0.33)
  Top 0.254: v45.72,7.11 45.85,6.99 R43.2 46.82,4.03 47.29,4.49 Q17.C | v44.83,9.76 Q16.B
  Bottom 0.254: v45.72,7.11 44.83,8 v44.83,9.76
NTC1  (via drill 0.33)
  Top 0.254: U1.8 19.64,34.59 20.45,33.78 20.45,32 v20.07,31.62
  Bottom 0.254: v20.07,31.62 20.32,31.62 23.11,28.83 29.21,28.83 29.46,29.08 | R23.1 32.64,32.26 29.46,29.08 | J12.2 29.46,29.08
PL
  Top 0.254: J8.2 51.47,8.04 R52.1 52.28,6.3 R51.2 52.28,2.76 J3.2
PL17MA
  Top 0.254: Q14.C 57.15,3.94 J3.1
PV_IN  (via drill 0.33, 0.81)
  Top 0.254: R2.1 7.37,6.86 6.48,6.86 v6.1,7.24 | 3.02,11.81 D1.K 3.27,11.56 v4.57,11.56
  Top 1.016: D1.K 2.92,14.35 TP5.TP
  Bottom 0.254: v6.1,7.24 6.1,10.03 v4.57,11.56
  Bottom 1.016: TP5.TP 11.43,22.86 11.43,29.97 6.73,34.67 6.73,38.48 v10.16,41.91
  pour Top (isolate 0.406, no thermals): 10.41,44.7 15.62,44.7 15.62,42.8 11.3,42.8 11.3,40.01 11.94,39.37 13.21,39.37 14.73,37.85 14.73,37.21 13.08,37.21 11.94,38.35 9.53,38.35 9.53,43.81
PV_IN_ADC6  (via drill 0.33)
  Top 0.254: R34.1 R35.2 10.07,11.98 14.61,16.51 45.47,16.51 46.1,17.14 51.18,17.14 51.82,16.51 60.07,16.51 60.58,17.02 61.34,17.02 61.85,16.51 71.75,16.51 v72.14,16.89 | U6.19 62.91,50.42 v63.63,50.42 64.77,51.56 65.79,51.56 66.67,52.45 v67.94,52.45 | C18.1 J5.7
  Bottom 0.254: v67.94,52.45 67.94,62.87 J5.7 | v72.14,16.89 72.14,18.54 66.93,23.75 66.93,30.35 70.99,34.42 70.99,43.94 68.07,46.86 66.67,46.86 63.75,49.78 63.75,50.29 v63.63,50.42
PV_RAW
  Top 0.254: R34.2 5.08,9.02 3.97,7.91 D1.A
  Top 1.016: J1.4 2.2,3.26 1.78,3.68 1.78,5.59 3.05,6.86 3.05,7.78 D1.A
PWR  (via drill 0.33)
  Top 0.254: U3.4 16.23,52.17 R12.2 16.03,52.17 U4.3 | 26.04,49.91 26.04,50.25 R25.1 | 33.27,45.34 33.27,48.13 33.66,48.51 C2.1 34.29,49.02 33.78,49.53 33.78,51.18 | 33.78,51.18 34.54,51.18 35.05,50.67 37.93,50.67 R4.1 | R36.2 33.44,51.52 33.78,51.18 | 25.15,55.24 25.91,54.48 C17.1 25.91,53.85 v26.67,53.09 | 25.15,55.24 25.15,56.52 25.78,57.15 U5.5 | Q1.2(S) 36.87,43.61 R21.1 | D2.A 24.23,40.28 v24.26,40.26 | U1.9 20.26,35.23 v20.45,35.05 | TP4.TP 11.43,48.64 12.45,49.66 15.62,49.66 16.38,50.42 | 25.15,55.24 25.06,55.28 R18.1 23.5,55.37 23.28,55.37 22.48,56.17 R20.1
  Top 1.016: R12.2 16.13,50.67 16.38,50.42 16.89,49.91 26.04,49.91 v26.92,49.02 27.43,48.51 27.43,46.23 28.57,45.09 | R3.1 35.18,44.58 35.43,44.32 36.81,44.32 Q1.2(S)
  Bottom 0.254: v24.26,40.26 24.26,42.67 23.75,43.18 v23.5,43.18 | v20.45,35.05 20.83,34.67 20.83,33.15 23.62,30.35 28.7,30.35 30.48,32.13 30.48,39.12 32.13,40.77 32.13,42.93 v31.11,43.94 | v26.67,53.09 26.67,49.28 v26.92,49.02
  pour Top (isolate 0.406, no thermals): 34.29,45.34 34.16,43.56 26.42,43.56 25.65,42.8 21.08,42.8 21.08,44.7 25.65,44.7 25.91,44.96 27.18,44.96 27.56,45.34
PWR_ADC7  (via drill 0.33)
  Top 0.254: C19.1 70.61,62.74 J5.8 | v68.71,58.8 67.69,57.78 65.66,57.78 65.02,57.28 58.93,57.28 58.8,57.15 v58.55,57.15 58.17,57.15 56.52,55.5 54.36,55.5 53.09,54.23 52.58,54.23 51.82,53.47 47.5,53.47 46.99,53.98 43.81,53.98 41.4,56.39 41.4,57.15 40.01,58.55 v38.86,58.55 | U6.22 57.91,48.81 v57.91,49.15 | R37.2 34.25,53.21 R36.1 36.58,52.07 v36.96,51.69
  Bottom 0.254: J5.8 68.71,62.36 v68.71,58.8 | v58.55,57.15 58.29,56.9 58.29,52.32 58.55,52.07 58.55,49.78 v57.91,49.15 | v36.96,51.69 39.5,54.23 39.5,55.88 38.48,56.9 38.48,58.17 v38.86,58.55
RX  (via drill 0.33)
  Top 0.254: U6.30 48.72,46.99 48.64,46.99 48.13,47.5 48.13,48.39 47.75,48.77 46.74,48.77 v45.34,47.37 | v42.55,22.35 42.93,21.97 58.93,21.97 59.44,22.48 60.33,22.48 62.1,20.7 63.25,20.7 v63.37,20.83
  Bottom 0.254: v45.34,47.37 45.09,47.12 45.09,42.93 43.69,41.53 43.69,35.94 43.56,35.81 43.56,29.97 42.29,28.7 42.29,22.99 42.55,22.73 v42.55,22.35 | v63.37,20.83 63.37,20.32 64.77,18.92 J9.3
SCK  (via drill 0.33)
  Top 0.254: R48.2 18.63,12.91 19.56,13.84 28.83,13.84 J10.5 | v65.91,20.19 65.66,19.94 36.2,19.94 35.94,20.19 34.8,20.19 v34.16,19.56 | U6.17 59.44,44.04 59.44,43.05 63.5,38.99 64.01,38.99 J11.3
  Bottom 0.254: J11.3 63.75,38.1 62.23,36.58 62.23,35.56 63.25,34.54 63.25,34.04 62.48,33.27 62.48,24.51 63.5,23.5 63.5,22.99 65.91,20.57 v65.91,20.19 | v34.16,19.56 33.4,18.8 33.4,17.14 32.89,16.64 31.62,16.64 J10.5
SCL  (via drill 0.33)
  Top 0.254: U6.28 50.04,47.94 50.04,48.13 49.4,48.77 48.9,48.77 48.26,49.4 46.35,49.4 45.34,48.39 44.58,48.39 44.32,48.13 44.32,43.18 44.7,42.8 44.7,41.4 43.43,40.13 42.8,40.13 42.42,39.75 42.42,38.61 41.78,37.97 39.37,37.97 v39.12,37.72 | v37.59,22.73 36.32,21.46 33.78,21.46 31.5,19.18 23.5,19.18 23.11,19.56 22.35,19.56 21.46,18.67 v20.07,18.67
  Bottom 0.254: v39.12,37.72 39.5,37.34 39.5,32.77 38.99,32.26 38.99,24.13 v37.59,22.73 | v20.07,18.67 J10.1
SCL1  (via drill 0.33)
  Top 0.254: U6.6 52.5,40.01 53.21,40.01 54.1,39.12 54.1,38.1 54.86,37.34 54.86,36.58 55.5,35.94 61.98,35.94 62.23,35.69 v62.23,34.29
  Bottom 0.254: v62.23,34.29 62.23,34.04 61.85,33.66 61.85,24.13 62.87,23.11 62.87,22.61 65.02,20.45 65.02,19.68 65.66,19.05 65.66,16.89 J9.2
SDA  (via drill 0.33)
  Top 0.254: U6.27 49.7,49.4 49.2,49.4 48.56,50.04 45.97,50.04 45.09,49.15 44.2,49.15 43.56,48.51 43.56,42.8 43.94,42.42 43.94,41.66 43.31,41.02 42.42,41.02 41.78,41.66 39.88,41.66 v39.5,42.04 | v38.86,22.73 37.85,21.72 37.59,21.72 36.7,20.83 34.16,20.83 31.88,18.54 v22.61,18.54
  Bottom 0.254: v39.5,42.04 40.13,41.4 40.13,32.38 39.75,32 39.75,23.62 v38.86,22.73 | v22.61,18.54 J10.2
SDA1  (via drill 0.33)
  Top 0.254: U6.3 49.23,40.13 v48.26,40.13 | v47.12,24.26 47.24,24.13 51.82,24.13 52.2,24.51 52.96,24.51 54.1,23.37 58.17,23.37 58.8,24 60.71,24 61.09,23.62 62.36,23.62 62.87,23.11 62.87,22.35 63.5,21.72 63.75,21.72 64.39,21.08 66.29,21.08 67.18,20.19 68.07,20.19 v68.96,19.3
  Bottom 0.254: v48.26,40.13 47.5,39.37 47.5,27.94 46.35,26.8 46.35,24.77 46.86,24.26 v47.12,24.26 | v68.96,19.3 68.96,19.18 67.82,18.03 67.82,17.27 J9.1
SENSE  (via drill 0.33)
  Top 0.254: U1.10 21.27,35.88 v21.46,35.69
  Bottom 0.254: v21.46,35.69 21.46,33.53 23.88,31.11 28.45,31.11 29.72,32.38 29.72,39.88 v31.11,41.27
  pour Top (isolate 0.406, no thermals): 27.81,42.55 34.42,42.55 34.42,32.64 32,32.64 32,40.89 27.81,40.89
SW
  pour Top (isolate 0.406, no thermals): 18.16,37.21 18.16,37.34 18.41,37.59 18.8,37.59 20.07,38.86 20.07,39.24 19.3,40.01 17.91,40.01 17.91,40.89 19.18,40.89 20.45,39.62 21.21,39.62 21.84,38.99 24.26,38.99 26.04,37.21 26.04,34.67 24.51,34.67 24.38,37.72 23.88,38.23 21.46,38.23 21.08,38.61 20.95,38.61 19.56,37.21
TC+  (via drill 0.33)
  Top 0.254: R26.1 R25.2 28.03,50.71 27.05,51.69 v25.4,51.69
  Bottom 0.254: v25.4,51.69 25.27,51.69 24.13,52.83 24.13,53.47 23.37,54.23 22.73,54.23 21.59,55.37 21.59,57.66 21.34,57.91 19.3,57.91 17.4,59.82 17.4,60.83 16,62.23 J7.3
TC-  (via drill 0.33)
  Top 0.254: R26.2 29.67,46.9 R24.2 31.75,49.57 R27.2 29.55,50.71 28.57,51.69 28.07,51.69 27.43,52.32 26.04,52.32 v25.53,52.83
  Bottom 0.254: v25.53,52.83 25.53,53.09 23.75,54.86 23.11,54.86 22.23,55.75 22.23,58.17 21.72,58.67 19.56,58.67 18.16,60.07 18.16,62.19 J7.4
TX  (via drill 0.33)
  Top 0.254: U6.31 47.34,47.24 46.48,47.24 45.97,46.74 v45.97,46.48 | v43.56,22.86 43.81,22.61 58.42,22.61 59.05,23.24 60.45,23.24 60.96,22.73 v61.98,22.73
  Bottom 0.254: v45.97,46.48 45.85,46.35 45.85,42.8 44.45,41.4 44.45,35.81 44.32,35.69 44.32,29.59 43.05,28.32 43.05,23.37 v43.56,22.86 | v61.98,22.73 61.98,21.08 61.72,20.83 61.72,20.45 60.58,19.3 60.58,17.65 61.21,17.02 61.34,17.02 62.23,16.13 J9.4
VIN  (via drill 0.33, 0.41, 1.02)
  Top 0.254: Q10.2(S) 59.88,9.33 v60.71,8.51 | 75.18,12.83 R38.2 75.31,12.83 v76.2,11.94 75.95,12.19 | v42.04,45.21 42.04,45.97 42.38,46.31 Q2.1(G) | R45.1 48.71,61.05 Q18.2(S)
  Top 0.406: Q20.C 16.68,4.78 v17.27,4.19 | Q22.C 20.49,4.23 v20.45,4.19 | Q27.C 24.3,4.49 v24,4.19 | Q29.C 28.11,4.49 v27.81,4.19 | Q24.C 31.92,4.49 v31.62,4.19 | Q32.C 35.73,4.49 v35.43,4.19 | v42.04,45.21 42.04,44.2 42.42,43.81 42.42,42.55 v42.93,42.04
  Top 0.813: U2.1 48.33,61.03 Q18.2(S)
  Top 1.016: Q1.3(D) v42.04,45.21
  Bottom 0.254: v60.71,8.51 60.71,5.46 74.68,5.46 76.58,7.37 76.58,11.56 v76.2,11.94 | 42.04,5.59 42.04,5.46
  Bottom 0.406: v17.27,4.19 v20.45,4.19 v24,4.19 v27.81,4.19 v31.62,4.19 v35.43,4.19 40.77,4.19 42.04,5.46 43.31,4.19 49.4,4.19 50.67,5.46 60.71,5.46 | v42.93,42.04 42.93,36.32 42.67,36.07 42.67,30.35 41.53,29.21 41.53,18.67 44.32,15.88 44.32,14.61 43.31,13.59 42.93,13.59 42.04,12.7 42.04,5.59
  Bottom 1.016: v42.04,45.21 42.04,56.77 43.18,57.91 46.74,57.91 46.99,58.17 U2.1
VIN-DISCON
  Top 0.254: C2.2 35.27,46.74 R7.1 | Q1.1(G) 36.87,46.73 R7.1 | R7.1 37.08,47.54 R4.2 39.37,48.55 Q2.3(D)
VOUT
  Top 0.813: Q18.3(D) 50.88,62.02 50.42,62.48 50.42,63.63 50.16,63.88 47.37,63.88 J6.1

## Text on the board
tPlace: RPUno | RPUBUS.ORG
bPlace: NC | NC | 5V | 0V | 0V | 0V | NC | IOREF 5V | !RESET | ADC0 C0 | ADC1 C1 | ADC2 C2 | ADC3 C3 | NC | NC | ADC6 E2 | ADC7 E3 | +BAT | 0V | 5V | -BAT | B=4250 / 100K | S2: CONNECT / BAT TO CC | S1: VIN / CONNECT | 12V / SLA | PWR | SHIELD VIN IS / CNTRLD BY D2 (IO2) | 13.278V:50.7k at 40ºC / 13.63V:100k at 25ºC / 14.068V:357k at 0ºC | VIN | 0V | POWER MCU AT 13.1V / DISCONNECT AT 11.58V. | !RESET | MOSI | SCK | IOREF | MISO | RPUno | RPUBUS.ORG | 14140^6 | 10k B=3380 NTC / CHRG IF > 0ºC / CHRG IF < 40ºC | SPI | MPP IDEAL:ACTUAL / 13.8:14.5V-15.2k at 70ºC / 15.8:15.7V-50.7k at 40ºC / 17:16.8V-100k at 25ºC / 19:18.7V-357k at 0ºC | CHARGE RATE IS FUNCTION / OF PV POWER UP TO MAX, / ABOUT 0.11A PER WATT. | C5 SCL | C4 SDA | +5V (*E1) | 0V (*E0) | NC | 0V | B5 SCK | B4 MISO | B3 MOSI/OC2A | B2 !SS!/OC1B | B1 OC1A | B0 ICP1 | D7 | D6 OC0A | D5 OC0B/T1 | D4 T0 | D3 INT1/OC2B | D2 INT0 | D1 TX | D0 RX | 36 CELL / STRING | SCL | SDA | NC | 0V | 13 | 12 | 11 | 10 | 9 | 8 | 7 | 6 | 5 | 4 | 3 | 2 | 1 | 0 | 5V | 0V | FT/PULSE | B=4250 / 100K | DIGITAL IO | ANALOG LOOP | 12V / 22mA | 10mA / TO PL | 13 | 12 | 11 | 10 | 4 | 3 | 0V | 12V / 17mA | 12V / 22mA | ADC1 | 0V | ADC0 | 12V / 22mA | +PV | -PV | 0V | PL